# Altium schematic sheet SH1 - POWER.SchDoc: Power
size B; Engineer: Farris Matar; Organization: UW Robotics; Address1: 200 University Avenue; Address2: Waterloo; Address3: Ontario; Address4: Canada N2L 3G6; DocumentNumber: 1; Revision: 3; SheetNumber: 1; SheetTotal: 9
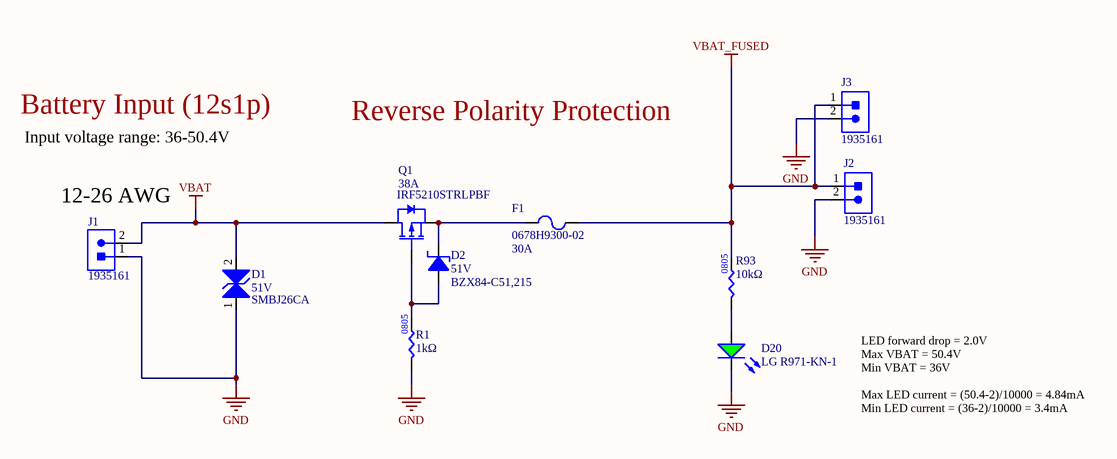
[diagram p0: SH1 - POWER.SchDoc]

## Parts
D1  Manufacturer Part Number 1: SMBJ26CA  Voltage - Reverse Standoff (Typ): 51V  [TVS_DIODE_BIDIR_SMB]  (hidden comment: TVS_DIODE_BIDIR_51V)
D2  Manufacturer Part Number 1: BZX84-C51,215  Working Voltage: 51V  [SOT23-3]  (hidden comment: DIO_ZENER_51V)
D20  Manufacturer Part Number 1: LG R971-KN-1  [LED_0805_GREEN]  (hidden comment: LED_GREEN)
F1  Manufacturer Part Number 1: 0678H9300-02  Current Rating: 30A  [FUSE_3912]  (hidden comment: FUSE_30A_3912)
J1  CON_2M_TERM  [1935161]  (value not drawn)
J2  CON_2M_TERM  [1935161]  (value not drawn)
J3  CON_2M_TERM  [1935161]  (value not drawn)
Q1  Current - Continous Drain: 38A  Manufacturer Part Number 1: IRF5210STRLPBF  [DPAK254P1524X483-4_3N - new]  (hidden comment: PMOS_100V_38A)
R1  value 1kΩ  [RES0805]  (hidden comment: RES_1kΩ_0805_1%)
R93  value 10kΩ  [RES0805]  (hidden comment: RES_10kΩ_0805_5%)

## Nets
GND: D1.1 D20.2(K) J1.1 J2.2 J3.2 R1.1
VBAT: D1.2 J1.2 Q1.2(Drain)
VBAT_FUSED: F1.2 J2.1 J3.1 R93.2
NetD2_1: D2.1(Anode) Q1.1(Gate) R1.2
NetD2_3: D2.3(Cathode) F1.1 Q1.3(Source)
NetD20_1: D20.1(A) R93.1

## Notes on the sheet
- Battery Input (12s1p)
- Input voltage range: 36-50.4V
- Reverse Polarity Protection
- (near J1) 12-26 AWG
- LED forward drop = 2.0V
  Max VBAT = 50.4V
  Min VBAT = 36V
  Max LED current = (50.4-2)/10000 = 4.84mA
  Min LED current = (36-2)/10000 = 3.4mA
- Title:
- Project:
- Date:
- Rev:
- Reviewer:
- Engineer:
- Sheet:
- of

## Library data of the parts
D1 = TVS_DIODE_BIDIR_51V: TVS DIODE 51VWM 82.4VC DO214AA; Manufacturer 1: Littelfuse; Package/Footprint: SMB; Voltage - Clamping (Max) @ Ipp: 82.4V; Voltage - Breakdown (Min): 56.7V; Mounting Type: SMD; Supplier 1: Digi-Key; Supplier Part Number 1: SMBJ51CALFCT-ND; Supplier 2: Digi-Key; Supplier Part Number 2: SMBJ51CA-FDIDKR-ND
D2 = DIO_ZENER_51V: DIODE ZENER 51V 250MW TO236AB; Manufacturer 1: Nexperia USA Inc.; Forward Voltage: 0.9V; Supplier Part Number 1: 1727-5037-1-ND; Supplier 1: Digi-Key; Package/Case: SOT-23-3
D20 = LED_GREEN: LED GREEN DIFFUSED 0805 SMD; Manufacturer 1: OSRAM; Forward Voltage Drop: 2.2V; Package/Footprint: 0805; Mounting Type: SMD; Supplier 1: Digi-Key; Supplier Part Number 1: 475-1410-1-ND; Supplier 2: Future Electronics; Supplier Part Number 2: 1152237
F1 = FUSE_30A_3912: FUSE SMT 3912 ENH BRK 250V 30A; Manufacturer 1: Bel Fuse Inc.; Package/Footprint: 3912; Supplier 1: Digi-Key; Supplier Part Number 1: 507-2254-1-ND; Mounting Type: SMD; Verified: No
J1-J3 = CON_2M_TERM: TERM BLK 2POS SIDE ENTRY 5MM; Manufacturer 1: Phoenix Contact; Voltage: 300V; Current: 18A; Max Current Rating: 16A; Package/Footprint: SMD; Supplier 1: Digi-Key; Manufacturer Part Number 1: 1935161; Supplier Part Number 1: 277-1667-ND; Mounting Type: TH
Q1 = PMOS_100V_38A: MOSFET P-CH 100V 38A D2PAK; Manufacturer 1: Vishay Siliconix; Vgs (Max): ±15V; Id: 120A; Mounting Type: SMD; Verified: No; Vdss: 100V; Supplier 1: Digi-Key; Supplier Part Number 1: IRF5210STRLPBFCT-ND; Package/Footprint: D2Pak
R1 = RES_1kΩ_0805_1%: RES 1K OHM 1% 1/8W 0805; Manufacturer 1: Yageo; Manufacturer Part Number 1: RC0805FR-071KL; Package: 0805; Supplier Part Number 1: 311-1.00KCRCT-ND; Supplier 1: Digi-Key; Mounting Type: SMD; LCSC Part #: C17513
R93 = RES_10kΩ_0805_5%: RES 10K OHM 5% 1/8W 0805; Manufacturer 1: Panasonic Electronic Components; Manufacturer Part Number 1: ERJ-6GEYJ103V; Package/Footprint: 0805; Supplier Part Number 1: P10KACT-ND; Supplier 1: Digi-Key; LCSC Part #: C17414; Mounting Type: SMD